# Altium schematic sheet Motor.SchDoc
size OrCAD A
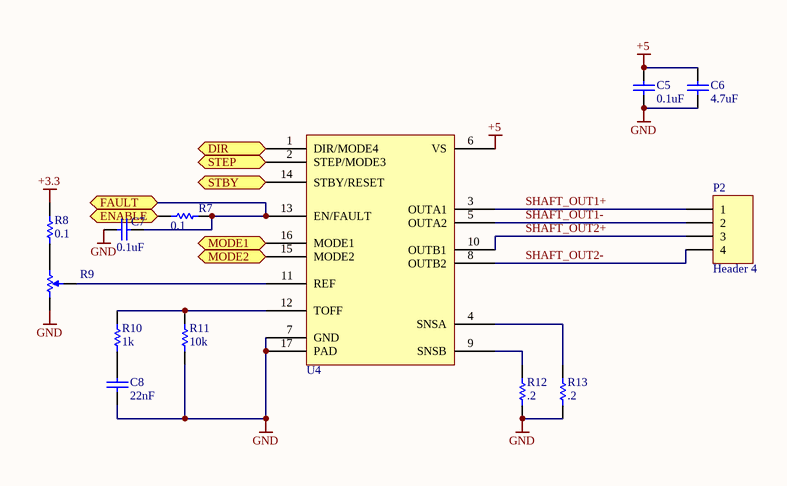
[diagram p0: Motor.SchDoc]

## Parts
C5  0.1uF  [CAPC1608X94X35LL15T15]
C6  4.7uF  [CAPC0603(1608)55_M]
C7  0.1uF  [CAPC1608X94X35LL15T15]
C8  22nF  [CAPC1608X94X35LL15T15]
P2  Header 4  [HDR1X4]
R7  0.1  [RESC0603(1608)_N]
R8  0.1  [RESC0603(1608)_N]
R9  3313J-1-503E  [BOUR-3313J-1_V]  (value not drawn)
R10  1k  [RESC0603(1608)_N]
R11  10k  [RESC0603(1608)_N]
R12  .2  [RESC0603(1608)_N]
R13  .2  [RESC0603(1608)_N]
U4  STSPIN220  [STSPIN220-QFN127P600-8N]  (value not drawn)

## Ports
DIR, ENABLE, FAULT, MODE1, MODE2, STBY, STEP

## Nets
+3.3: R8.2
+5: C5.1 C6.2 U4.6(VS)
GND: C5.2 C6.1 C7.1 C8.2 R9.1 R11.1 R12.1 R13.1 U4.7(GND) U4.17(PAD)
DIR: U4.1(DIR/MODE4) ; port DIR
ENABLE: R7.2 ; port ENABLE
FAULT: C7.2 R7.1 U4.13(EN/FAULT) ; port FAULT
MODE1: U4.16(MODE1) ; port MODE1
MODE2: U4.15(MODE2) ; port MODE2
SHAFT_OUT1+: P2.1 U4.3(OUTA1)
SHAFT_OUT1-: P2.2 U4.5(OUTA2)
SHAFT_OUT2+: P2.3 U4.10(OUTB1)
SHAFT_OUT2-: P2.4 U4.8(OUTB2)
STBY: U4.14(STBY/RESET) ; port STBY
STEP: U4.2(STEP/MODE3) ; port STEP
NetC8_1: C8.1 R10.1
NetR8_1: R8.1 R9.3
NetR9_2: R9.2 U4.11(REF)
NetR10_2: R10.2 R11.2 U4.12(TOFF)
NetR12_2: R12.2 U4.9(SNSB)
NetR13_2: R13.2 U4.4(SNSA)

## Notes on the sheet
- Title
- Size:
- Date:
- Orcad A
- Number:
- Time:
- Revision:
- Sheet
- of
- ZLS Corporation
- 7801 North Lamar Blvd.
- Suite E-184
- Austin, Texas 78752  USA
- (512) 453-0288
- File:

## Library data of the parts
C5 C7 C8 = CMP-1661-00001-2: CAP .1UF 16V CERAMIC X7R 0603; Manufacturer: Yageo; Manufacturer Part Number: CC0603KRX7R7BB105; Capacitance: 1uF; Tolerance: 10%; Dissipation Factor: 5%; ComponentLink1Description: Datasheet; ComponentLink1URL: http://datasheets.avx.com/X7RDielectric.pdf; Supplier 1: Digi-Key; Supplier Part Number 1: 311-1446-6-ND; Stock 1: 5506121; Pricing 1: 1=0.21, 10=0.143, 100=0.0727, 500=0.04974, 1000=0.044 (USD); Mount: Surface Mount; Case/Package: 0603; Number of Pins: 2; Case Code (Metric): 1608; Case Code (Imperial): 0603; Min Operating Temperature: -55°C; Max Operating Temperature: 125°C; Voltage Rating: 16V; Package Quantity: 1; Packaging: Tape and Reel; Voltage Rating (DC): 16V; Dielectric: X7R; Termination: SMD/SMT; Voltage: 16V; Composition: Ceramic; Length: 1.6mm; Height: 0.8mm; Width: 0.031inch; Thickness: 0.035inch; Depth: 0.8mm; Radiation Hardening: No; REACH SVHC: Unknown; Lead Free: Lead Free; Halogen Free: Halogen Free; ComponentLink2URL: http://www.yageo.com/documents/recent/UPY-GPHC_X7R_6.3V-to-50V_18.pdf; ComponentLink2Description: http://www.yageo.com/documents/recent/UPY-GPHC_X7R_6.3V-to-50V_18.pdf; ComponentLink3URL: http://www.yageo.com/documents/recent/UPY-GPHC_X7R_6.3V-to-50V_8.pdf; ComponentLink3Description: http://www.yageo.com/documents/recent/UPY-GPHC_X7R_6.3V-to-50V_8.pdf; ComponentLink4URL: http://www.farnell.com/datasheets/1734573.pdf; ComponentLink4Description: http://www.farnell.com/datasheets/1734573.pdf; ComponentLink5URL: http://www.farnell.com/datasheets/1489800.pdf; ComponentLink5Description: http://www.farnell.com/datasheets/1489800.pdf
C6 = CMP-1035-02779-1: CAP 4.7uF 6.3V ±10% 0603 (1608 Metric) Thickness 0.55mm SMD; Manufacturer: KEMET; Manufacturer Part Number: C0603C475K9PACTU; Case-EIA: 0603; Tolerance: Â±10%; Case-Metric: 1608; Dielectric Material: Ceramic; Dielectric: X5R; Dissipation Factor: 5%; Technology: SMT; Value: 4.7uF; Max Thickness: 0.55 mm; Rated Voltage: 6.3 V; Supplier 1: Digi-Key; Supplier Part Number 1: 399-3482-6-ND; Stock 1: 1765509; Pricing 1: 1=0.21, 10=0.15, 100=0.0706, 500=0.04952, 1000=0.041 (USD); Mount: PCB,Surface Mount; Case/Package: 0603; Number of Pins: 2; Case Code (Metric): 1608; Case Code (Imperial): 0603; Contact Plating: Matte,Tin; Min Operating Temperature: -55°C; Max Operating Temperature: 85°C; Package Quantity: 1; Capacitance: 4.7uF; Voltage Rating: 6.3V; Packaging: Tape and Reel; Termination: SMD/SMT; Voltage Rating (DC): 6.3V; Voltage: 6.3V; Length: 1.6mm; Height: 0.8mm; Width: 0.031inch; Thickness: 0.035inch; Depth: 0.8mm; Lead Pitch: 0.7mm; Radiation Hardening: No; Lead Free: Lead Free; REACH SVHC: No SVHC; ComponentLink1URL: https://api.kemet.com/component-edge/download/datasheet/C0603C475K9PACTU.pdf; ComponentLink1Description: https://api.kemet.com/component-edge/download/datasheet/C0603C475K9PACTU.pdf; ComponentLink2URL: http://www.farnell.com/datasheets/1732700.pdf; ComponentLink2Description: http://www.farnell.com/datasheets/1732700.pdf; ComponentLink3URL: http://www.farnell.com/datasheets/1789732.pdf; ComponentLink3Description: http://www.farnell.com/datasheets/1789732.pdf; ComponentLink4URL: http://www.farnell.com/datasheets/40889.pdf; ComponentLink4Description: http://www.farnell.com/datasheets/40889.pdf
P2 = Header 4: Header, 4-Pin; LatestRevisionDate: 17-Jul-2002; LatestRevisionNote: Re-released for DXP Platform.; Publisher: Altium Limited
R7 R8 R10-R13 = CMP-1012-00511-1: 0R12 0.1W 1% 0603 (1608 Metric)  SMD; Manufacturer: Vishay; Manufacturer Part Number: CRCW060310K0FKEA; Value: 1020.00 Ohm; Case-EIA: 0603; Case-Metric: 1608; Resistance: 10kR; Power Rating: 100mW; Voltage Rating: 75V; Temperature Coefficient: 100ppm/°C; Technology: SMT; Power: 0.1 W; Tolerance: 1 %; Supplier 1: Digi-Key; Supplier Part Number 1: 311-0.0GRDKR-ND; Stock 1: 49641653; Pricing 1: 1=0.1, 10=0.021, 25=0.0152, 50=0.0114, 100=0.0084, 250=0.00644, 500=0.00514, 1000=0.00379 (USD); Case/Package: 0603; Number of Pins: 2; Weight: 7.1E-05oz; Case Code (Metric): 1608; Case Code (Imperial): 0603; Contact Plating: Lead,Tin; Min Operating Temperature: -55°C; Max Operating Temperature: 155°C; Packaging: Tape and Reel; Package Quantity: 10; Composition: Thick Film; Military Standard: Not; Termination: SMD/SMT; Voltage Rating (DC): 75V; Number of Terminations: 2; Max Power Dissipation: 100mW; Features: Automotive AEC-Q200; Length: 1.55mm; Height: 0.45mm; Width: 0.033inch; Depth: 0.85mm; Radiation Hardening: No; REACH SVHC: Unknown; Lead Free: Lead Free; ComponentLink1URL: http://www.vishay.com/docs/20008/dcrcw.pdf; ComponentLink1Description: http://www.vishay.com/docs/20008/dcrcw.pdf; ComponentLink2URL: https://www.verical.com/server-webapp/html/getDatasheet?partID=86831; ComponentLink2Description: https://www.verical.com/server-webapp/html/getDatasheet?partID=86831; ComponentLink3URL: http://www.farnell.com/datasheets/2310790.pdf; ComponentLink3Description: http://www.farnell.com/datasheets/2310790.pdf; ComponentLink4URL: http://www.vishay.com/docs/20035/dcrcwe3.pdf; ComponentLink4Description: http://www.vishay.com/docs/20035/dcrcwe3.pdf; ComponentLink5URL: http://www.farnell.com/datasheets/2111203.pdf; ComponentLink5Description: http://www.farnell.com/datasheets/2111203.pdf; ComponentLink6URL: http://uk.rs-online.com/webdocs/0d98/0900766b80d98afc.pdf; ComponentLink6Description: http://uk.rs-online.com/webdocs/0d98/0900766b80d98afc.pdf
R9 = CMP-2000-05588-1: 3 mm Trimpot(R) Trimming Potentiometer, 50 KOhm, +/- 20%, 0.125 W, -55 to 125 degC, 3-Pin SMD, RoHS, Tape and Reel; Manufacturer: Bourns; SVHC: NoSVHC(19-Dec-2012); Temperature Coefficient: ±150ppm/°C; No. of Turns: 1; Power Rating: 125mW; Track Resistance: 50kohm; Manufacturer URL: http://www.bourns.com/; Potentiometer Mounting: SMD; Package Description: 3-Pin Surface Mount Device, Body 3.5 x 3.2 mm, Pitch 1.15 mm; Package Reference: 3313J-1; Mounting Technology: SurfaceMount; Resistance Tolerance: ±20%; Datasheet Version: 05/2016; Datasheet URL: http://www.bourns.com/docs/Product-Datasheets/3313.pdf